# Altium schematic sheet AD9102_DDS.SchDoc
size A4
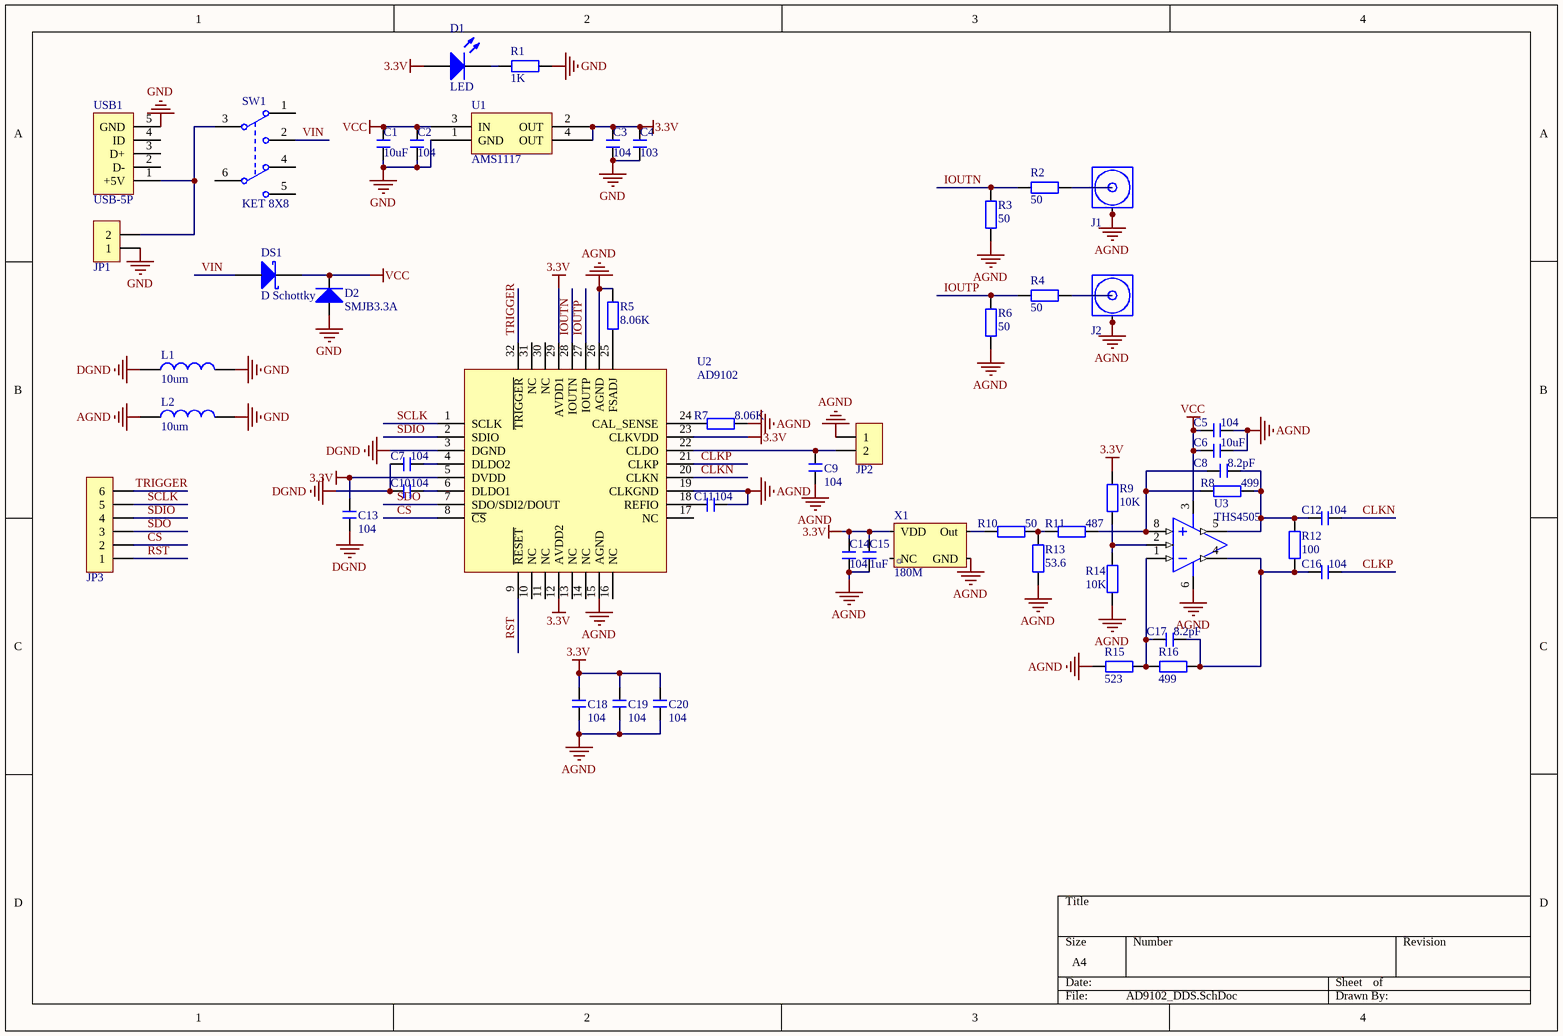
[diagram p0: AD9102_DDS.SchDoc]

## Parts
C1  10uF  [C 0805]
C2  104  [C 0603]
C3  104  [C 0603]
C4  103  [C 0603]
C5  104  [C 0603]
C6  10uF  [C 0603]
C7  104  [C 0603]
C8  8.2pF  [C 0603]
C9  104  [C 0603]
C10  104  [C 0603]
C11  104  [C 0603]
C12  104  [C 0603]
C13  104  [C 0603]
C14  104  [C 0603]
C15  1uF  [C 0603]
C16  104  [C 0603]
C17  8.2pF  [C 0603]
C18  104  [C 0603]
C19  104  [C 0603]
C20  104  [C 0603]
D1  LED  [LED_0805]
D2  Type: SMJB3.3A  [DIODE-SMA]  (hidden comment: TVS)
DS1  D Schottky  [DIODE-SMA]
J1  COAX  [MCX5.08-5-H]  (value not drawn)
J2  COAX  [MCX5.08-5-H]  (value not drawn)
JP1  HDR-1X2  [XH2.54-2P_H]  (value not drawn)
JP2  HDR-1X2  [HDR-1X2]  (value not drawn)
JP3  HDR-1X6  [HDR-1X6]  (value not drawn)
L1  10um  [L 0805]
L2  10um  [L 0805]
R1  1K  [R 0805]
R2  50  [R 0603]
R3  50  [R 0603]
R4  50  [R 0603]
R5  8.06K  [R 0603]
R6  50  [R 0603]
R7  8.06K  [R 0603]
R8  499  [R 0603]
R9  10K  [R 0603]
R10  50  [R 0603]
R11  487  [R 0603]
R12  100  [R 0603]
R13  53.6  [R 0603]
R14  10K  [R 0603]
R15  523  [R 0603]
R16  499  [R 0603]
SW1  KET 8X8  [KFT DIP-8X8]
U1  AMS1117  [SOT223_N]
U2  AD9102  [CP_32_12]
U3  THS4505  [MSOP-MS8_M]
USB1  USB-5P  [USB-MICRO_B]
X1  Frequency: 180M  [X-CPX75]  (hidden comment: XTAL)

## Nets
3.3V: C3.2 C4.2 C13.2 C14.2 C15.2 C18.2 C19.2 C20.2 D1.1(A) R9.1 U1.2(OUT) U1.4(OUT) U2.5(DVDD) U2.12(AVDD2) U2.23(CLKVDD) U2.29(AVDD1) X1.4(VDD)
AGND: C5.1 C6.1 C9.1 C11.1 C14.1 C15.1 C18.1 C19.1 C20.1 J1.2(GND) J1.3(GND) J1.4(GND) J1.5(GND) J2.2(GND) J2.3(GND) J2.4(GND) J2.5(GND) JP2.1 L2.1 R3.1 R5.2 R6.1 R7.2 R13.2 R14.2 R15.2 U2.15(AGND) U2.19(CLKGND) U2.26(AGND) U3.6(VS-) X1.2(GND)
DGND: C7.1 C10.1 C13.1 L1.1 U2.3(DGND)
GND: C1.1 C2.1 C3.1 C4.1 D2.1(A) JP1.1 L1.2 L2.2 R1.2 U1.1(GND) USB1.5(GND)
VCC: C1.2 C2.2 C5.2 C6.2 D2.2(K) DS1.2 U1.3(IN) U3.3(VS+)
~{CS}: JP3.2 U2.8(~{CS})
CLKN: C12.1 U2.20(CLKN)
CLKP: C16.1 U2.21(CLKP)
IOUTN: R2.2 R3.2 U2.28(IOUTN)
IOUTP: R4.2 R6.2 U2.27(IOUTP)
RST: JP3.1 U2.9(~{RESET})
SCLK: JP3.5 U2.1(SCLK)
SDIO: JP3.4 U2.2(SDIO)
SDO: JP3.3 U2.7(SDO/SDI2/DOUT)
TRIGGER: JP3.6 U2.32(~{TRIGGER})
VIN: DS1.1 SW1.2(COM2)
NetC7_2: C7.2 U2.4(DLDO2)
NetC8_1: C8.1 C12.2 R8.1 R12.1 U3.5(VOUT-)
NetC8_2: C8.2 R8.2 R11.1 U3.8(+IN)
NetC9_2: C9.2 JP2.2 U2.22(CLDO)
NetC10_2: C10.2 U2.6(DLDO1)
NetC11_2: C11.2 U2.18(REFIO)
NetC16_2: C16.2 C17.1 R12.2 R16.1 U3.4(VOUT+)
NetC17_2: C17.2 R15.1 R16.2 U3.1(-IN)
NetD1_2: D1.2(K) R1.1
NetJ1_1: J1.1(Signal) R2.1
NetJ2_1: J2.1(Signal) R4.1
NetJP1_2: JP1.2 SW1.3(NO1) USB1.1(+5V)
NetR5_1: R5.1 U2.25(FSADJ)
NetR7_1: R7.1 U2.24(CAL_SENSE)
NetR9_2: R9.2 R14.1 U3.2(+IN)
NetR10_1: R10.1 R11.2 R13.1
NetR10_2: R10.2 X1.3(Out)

Not connected (* = marked no-connect by the designer): SW1 1(NC1) 4(NO2) 5(COM2) 6(NC2); U2 10(NC) 11(NC) 13(NC) 14(NC) 16(NC) 17(NC) 30(NC) 31(NC); USB1 2(D-) 3(D+) 4(ID); X1 1(NC)

## Library data of the parts
C1-C20 = C: 无极性贴片电容; 版权归属: 源创客; BOM名称: 无极性贴片电容; 学习资源: www.ooocke.com
D1 = LED: 发光二极管; Published: 8-Jun-2000; LatestRevisionDate: 08-Jul-2005; LatestRevisionNote: Mech Layer 1 removed.; PackageReference: LED; Publisher: Altium Limited
D2 = TVS: TVS保护; Published: 8-Jun-2000; LatestRevisionDate: 17-Jul-2002; LatestRevisionNote: Re-released for DXP Platform.; PackageDocument: Sep-1996; PackageReference: SMC; Publisher: Altium Limited; Code_JEDEC: DO-214-AB
DS1 = D Schottky: Schottky Diode; Published: 8-Jun-2000; LatestRevisionDate: 17-Jul-2002; LatestRevisionNote: Re-released for DXP Platform.; PackageReference: SMB; Publisher: Altium Limited; PackageDescription: DO-214-AA/SMB; 2 C-Bend Leads; Body 5.3 x 3.6 mm, inc. leads (LxW); Code_JEDEC: DO-214-AA
JP1 JP2 = Header 2: 2P接插件; 版权归属: 源创客; BOM名称: 2P接插件; 学习资源: www.ooocke.com
JP3 = Header 6: 6P接插件; 版权归属: 源创客; BOM名称: 6P接插件; 学习资源: www.ooocke.com
L1 L2 = L: 小功率贴片电感; 版权归属: 源创客; BOM名称: 小功率贴片电感; 学习资源: www.ooocke.com
R1-R16 = R: 贴片电阻; 版权归属: 源创客; BOM名称: 贴片电阻; 学习资源: www.ooocke.com
SW1 = KET 8X8: 8*8自锁开关; 版权归属: 源创客; BOM名称: 8*8自锁开关; 学习资源: www.ooocke.com
U1 = ASM1117: 线性稳压芯片
U2 = AD9102: 低功耗、14位、180MSPS数模转换器和波形发生器
U3 = THS4505: WIDEBAND, LOW-DISTORTION,FULLY DIFFERENTIAL AMPLIFIERS
USB1 = USB-5P: 微型USB母座; 版权归属: 源创客; BOM名称: 微型USB母座; 学习资源: www.ooocke.com
X1 = XTAL_Oscillator: 有源晶振